# Altium schematic sheet driver.SchDoc
size A4
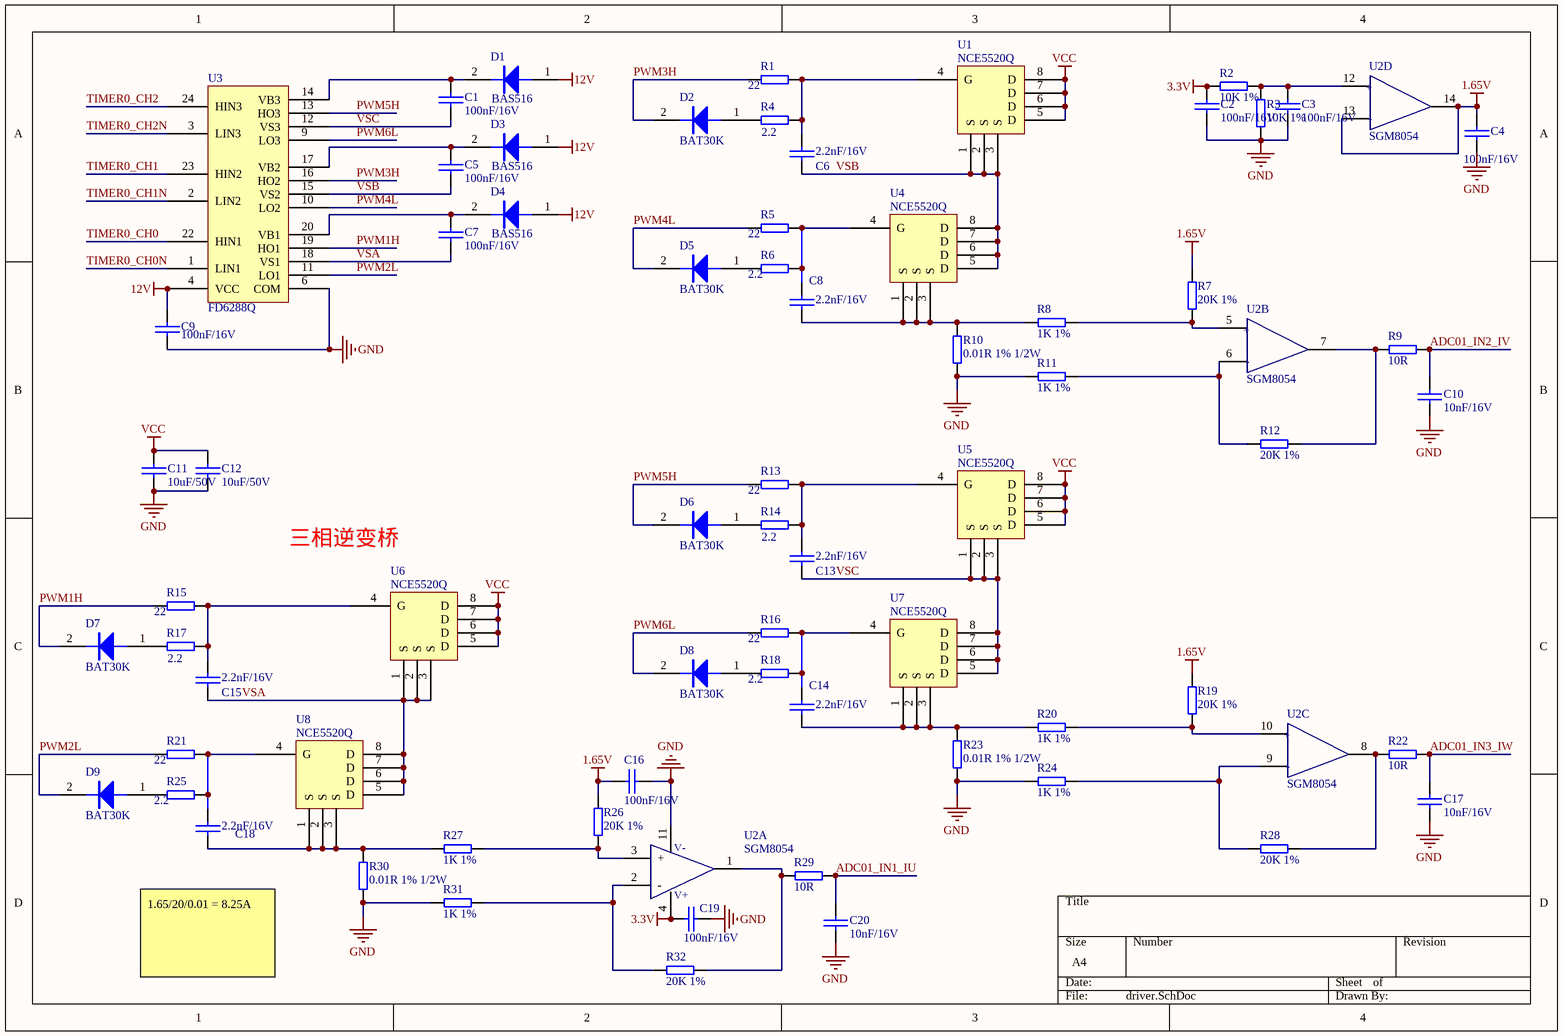
[diagram p0: driver.SchDoc]

## Parts
C1  100nF/16V  [C0402]
C2  100nF/16V  [C0402]
C3  100nF/16V  [C0402]
C4  100nF/16V  [C0402]
C5  100nF/16V  [C0402]
C6  2.2nF/16V  [C0402]
C7  100nF/16V  [C0402]
C8  2.2nF/16V  [C0402]
C9  100nF/16V  [C0402]
C10  10nF/16V  [C0402]
C11  10uF/50V  [C1206]
C12  10uF/50V  [C1206]
C13  2.2nF/16V  [C0402]
C14  2.2nF/16V  [C0402]
C15  2.2nF/16V  [C0402]
C16  100nF/16V  [C0402]
C17  10nF/16V  [C0402]
C18  2.2nF/16V  [C0402]
C19  100nF/16V  [C0402]
C20  10nF/16V  [C0402]
D1  BAS516  [SOD-523/SC-79]
D2  BAT30K  [SOD-523/SC-79]
D3  BAS516  [SOD-523/SC-79]
D4  BAS516  [SOD-523/SC-79]
D5  BAT30K  [SOD-523/SC-79]
D6  BAT30K  [SOD-523/SC-79]
D7  BAT30K  [SOD-523/SC-79]
D8  BAT30K  [SOD-523/SC-79]
D9  BAT30K  [SOD-523/SC-79]
R1  22  [R0402]
R2  10K 1%  [R0402]
R3  10K 1%  [R0402]
R4  2.2  [R0402]
R5  22  [R0402]
R6  2.2  [R0402]
R7  20K 1%  [R0402]
R8  1K 1%  [R0402]
R9  10R  [R0402]
R10  0.01R 1% 1/2W  [R0805]
R11  1K 1%  [R0402]
R12  20K 1%  [R0402]
R13  22  [R0402]
R14  2.2  [R0402]
R15  22  [R0402]
R16  22  [R0402]
R17  2.2  [R0402]
R18  2.2  [R0402]
R19  20K 1%  [R0402]
R20  1K 1%  [R0402]
R21  22  [R0402]
R22  10R  [R0402]
R23  0.01R 1% 1/2W  [R0805]
R24  1K 1%  [R0402]
R25  2.2  [R0402]
R26  20K 1%  [R0402]
R27  1K 1%  [R0402]
R28  20K 1%  [R0402]
R29  10R  [R0402]
R30  0.01R 1% 1/2W  [R0805]
R31  1K 1%  [R0402]
R32  20K 1%  [R0402]
U1  NCE5520Q  [DFN3X3-8L]
U2  SGM8054  [TSSOP-14]  (parts A,B,C,D of 4)
U3  FD6288Q  [QFN_P0.5_24]
U4  NCE5520Q  [DFN3X3-8L]
U5  NCE5520Q  [DFN3X3-8L]
U6  NCE5520Q  [DFN3X3-8L]
U7  NCE5520Q  [DFN3X3-8L]
U8  NCE5520Q  [DFN3X3-8L]

## Nets
1.65V: C4.1 C16.2 R7.1 R19.1 R26.1 U2.13(-) U2.14(OUT2)
3.3V: C2.1 C19.2 R2.1 U2.4(V+)
12V: C9.2 D1.1(A) D3.1(A) D4.1(A) U3.4(VCC)
GND: C2.2 C3.2 C4.2 C9.1 C10.2 C11.2 C12.2 C16.1 C17.2 C19.1 C20.2 R3.2 R10.2 R11.2 R23.2 R24.2 R30.2 R31.2 U2.11(V-) U3.6(COM)
VCC: C11.1 C12.1 U1.5(D) U1.6(D) U1.7(D) U1.8(D) U5.5(D) U5.6(D) U5.7(D) U5.8(D) U6.5(D) U6.6(D) U6.7(D) U6.8(D)
ADC01_IN1_IU: C20.1 R29.1
ADC01_IN2_IV: C10.1 R9.1
ADC01_IN3_IW: C17.1 R22.1
PWM1H: D7.2(K) R15.2 U3.19(HO1)
PWM2L: D9.2(K) R21.2 U3.11(LO1)
PWM3H: D2.2(K) R1.2 U3.16(HO2)
PWM4L: D5.2(K) R5.2 U3.10(LO2)
PWM5H: D6.2(K) R13.2 U3.13(HO3)
PWM6L: D8.2(K) R16.2 U3.9(LO3)
TIMER0_CH0: U3.22(HIN1)
TIMER0_CH0N: U3.1(LIN1)
TIMER0_CH1: U3.23(HIN2)
TIMER0_CH1N: U3.2(LIN2)
TIMER0_CH2: U3.24(HIN3)
TIMER0_CH2N: U3.3(LIN3)
VSA: C7.1 C15.2 U3.18(VS1) U6.1(S) U6.2(S) U6.3(S) U8.5(D) U8.6(D) U8.7(D) U8.8(D)
VSB: C5.1 C6.2 U1.1(S) U1.2(S) U1.3(S) U3.15(VS2) U4.5(D) U4.6(D) U4.7(D) U4.8(D)
VSC: C1.1 C13.2 U3.12(VS3) U5.1(S) U5.2(S) U5.3(S) U7.5(D) U7.6(D) U7.7(D) U7.8(D)
NetC1_2: C1.2 D1.2(K) U3.14(VB3)
NetC3_1: C3.1 R2.2 R3.1 U2.12(+)
NetC5_2: C5.2 D3.2(K) U3.17(VB2)
NetC6_1: C6.1 R1.1 R4.2 U1.4(G)
NetC7_2: C7.2 D4.2(K) U3.20(VB1)
NetC8_1: C8.1 R5.1 R6.2 U4.4(G)
NetC8_2: C8.2 R8.2 R10.1 U4.1(S) U4.2(S) U4.3(S)
NetC13_1: C13.1 R13.1 R14.2 U5.4(G)
NetC14_1: C14.1 R16.1 R18.2 U7.4(G)
NetC14_2: C14.2 R20.2 R23.1 U7.1(S) U7.2(S) U7.3(S)
NetC15_1: C15.1 R15.1 R17.2 U6.4(G)
NetC18_1: C18.1 R21.1 R25.2 U8.4(G)
NetC18_2: C18.2 R27.2 R30.1 U8.1(S) U8.2(S) U8.3(S)
NetD2_1: D2.1(A) R4.1
NetD5_1: D5.1(A) R6.1
NetD6_1: D6.1(A) R14.1
NetD7_1: D7.1(A) R17.1
NetD8_1: D8.1(A) R18.1
NetD9_1: D9.1(A) R25.1
NetR7_2: R7.2 R8.1 U2.5(+)
NetR9_2: R9.2 R12.1 U2.7(OUT2)
NetR11_1: R11.1 R12.2 U2.6(-)
NetR19_2: R19.2 R20.1 U2.10(+)
NetR22_2: R22.2 R28.1 U2.8(OUT2)
NetR24_1: R24.1 R28.2 U2.9(-)
NetR26_2: R26.2 R27.1 U2.3(+)
NetR29_2: R29.2 R32.1 U2.1(OUT1)
NetR31_1: R31.1 R32.2 U2.2(-)

## Notes on the sheet
- 三相逆变桥
- 1.65/20/0.01 = 8.25A

## Library data of the parts
C1-C20 = CAP: Capacitor
D1-D9 = DIODE
R1 R4-R6 R13-R18 R21 R25 = R
R2 R3 R7-R12 R19 R20 R22-R24 R26-R32 = Resistance
U1 U4-U8 = SI7465DP
U3 = FD6288Q: 峰岹科技